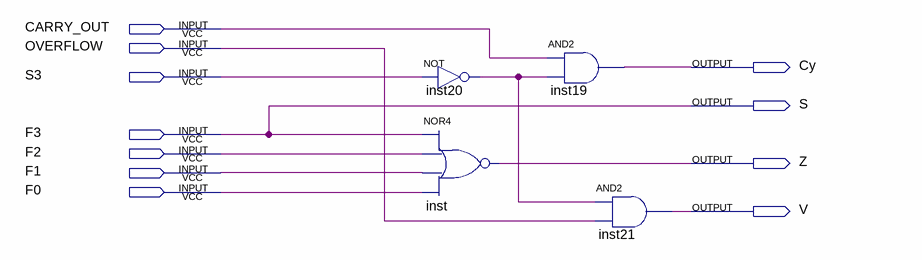
[diagram p0: schematic sheet]
// Quartus schematic State4bits.bdf as structural Verilog: 4 symbols, 11 pins
module State4bits (
  input  CARRY_OUT,
  input  OVERFLOW,
  input  S3,
  input  F3,
  input  F2,
  input  F1,
  input  F0,
  output Cy,
  output S,
  output Z,
  output V
);

  wire inst20_out;

  not inst20 (inst20_out, S3);
  nor inst (Z, F3, F2, F1, F0);
  and inst19 (Cy, CARRY_OUT, inst20_out);
  and inst21 (V, inst20_out, OVERFLOW);

  assign S = F3;
endmodule
